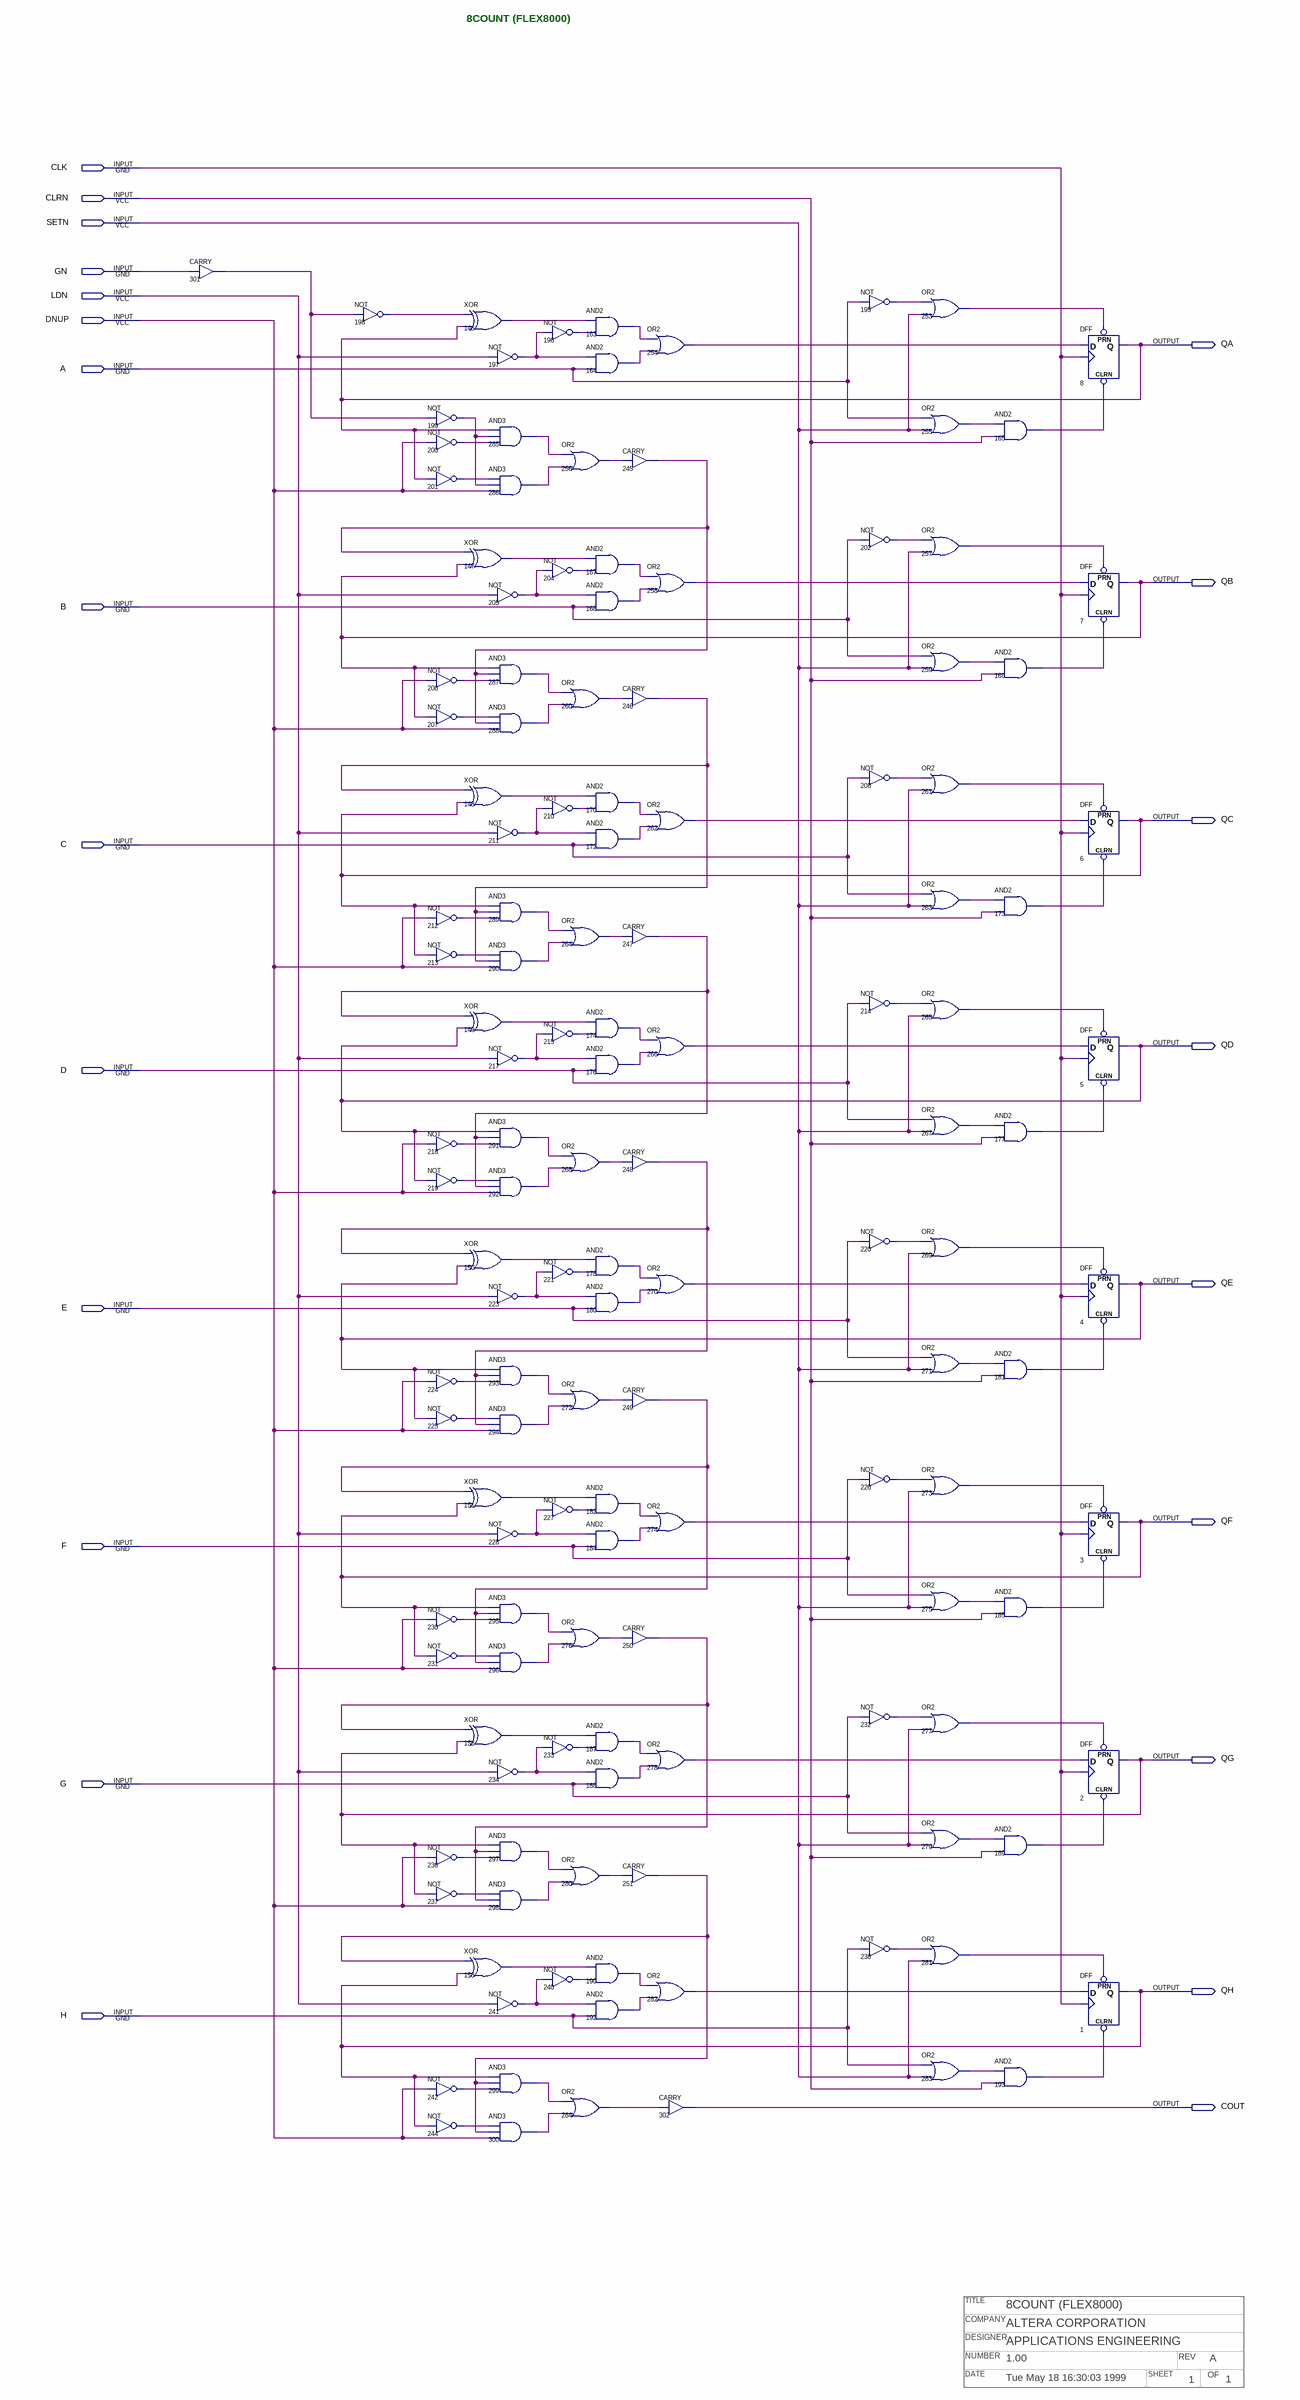
[diagram p0: schematic sheet]
// Quartus schematic f8count.bdf as structural Verilog: 139 symbols, 23 pins
// Title block: TITLE: 8COUNT (FLEX8000); COMPANY: ALTERA CORPORATION; DESIGNER: APPLICATIONS ENGINEERING; NUMBER: 1.00; REV: A; DATE: Tue May 18 16:30:03 1999; SHEET: 1; OF: 1
module f8count (
  input  CLK,
  input  CLRN,
  input  SETN,
  input  GN,
  input  LDN,
  input  DNUP,
  input  A,
  input  B,
  input  C,
  input  D,
  input  E,
  input  F,
  input  G,
  input  H,
  output QA,
  output QB,
  output QC,
  output QD,
  output QE,
  output QF,
  output QG,
  output QH,
  output COUT
);

  wire n146_out, n147_out, n148_out, n149_out, n150_out, n151_out, n152_out, n153_out, n163_out, n164_out,
       n165_out, n167_out, n168_out, n169_out, n170_out, n172_out, n173_out, n174_out, n176_out, n177_out,
       n178_out, n180_out, n181_out, n182_out, n184_out, n185_out, n187_out, n188_out, n189_out, n190_out,
       n192_out, n193_out, n195_out, n196_out, n197_out, n198_out, n199_out, n200_out, n201_out, n202_out,
       n204_out, n205_out, n206_out, n207_out, n208_out, n210_out, n211_out, n212_out, n213_out, n214_out,
       n215_out, n217_out, n218_out, n219_out, n220_out, n221_out, n223_out, n224_out, n225_out, n226_out,
       n227_out, n228_out, n230_out, n231_out, n232_out, n233_out, n234_out, n236_out, n237_out, n238_out,
       n240_out, n241_out, n242_out, n244_out, n245_out, n246_out, n247_out, n248_out, n249_out, n250_out,
       n251_out, n253_out, n254_out, n255_out, n256_out, n257_out, n258_out, n259_out, n260_out, n261_out,
       n262_out, n263_out, n264_out, n265_out, n266_out, n267_out, n268_out, n269_out, n270_out, n271_out,
       n272_out, n273_out, n274_out, n275_out, n276_out, n277_out, n278_out, n279_out, n280_out, n281_out,
       n282_out, n283_out, n284_out, n285_out, n286_out, n287_out, n288_out, n289_out, n290_out, n291_out,
       n292_out, n293_out, n294_out, n295_out, n296_out, n297_out, n298_out, n299_out, n300_out, n301_out;

  CARRY u_301 (.IN(GN), .OUT(n301_out));
  not u_198 (n198_out, n301_out);
  not u_199 (n199_out, n301_out);
  not u_200 (n200_out, DNUP);
  not u_201 (n201_out, QA);
  not u_206 (n206_out, DNUP);
  not u_207 (n207_out, QB);
  not u_212 (n212_out, DNUP);
  not u_213 (n213_out, QC);
  not u_218 (n218_out, DNUP);
  not u_219 (n219_out, QD);
  not u_224 (n224_out, DNUP);
  not u_225 (n225_out, QE);
  not u_230 (n230_out, DNUP);
  not u_231 (n231_out, QF);
  not u_236 (n236_out, DNUP);
  not u_237 (n237_out, QG);
  not u_242 (n242_out, DNUP);
  not u_244 (n244_out, QH);
  xor u_146 (n146_out, n198_out, QA);
  not u_197 (n197_out, LDN);
  and u_285 (n285_out, QA, n199_out, n200_out);
  and u_286 (n286_out, n201_out, n199_out, DNUP);
  xor u_147 (n147_out, n245_out, QB);
  not u_205 (n205_out, LDN);
  and u_287 (n287_out, QB, n245_out, n206_out);
  and u_288 (n288_out, n207_out, n245_out, DNUP);
  xor u_148 (n148_out, n246_out, QC);
  not u_211 (n211_out, LDN);
  and u_289 (n289_out, QC, n246_out, n212_out);
  and u_290 (n290_out, n213_out, n246_out, DNUP);
  xor u_149 (n149_out, n247_out, QD);
  not u_217 (n217_out, LDN);
  and u_291 (n291_out, QD, n247_out, n218_out);
  and u_292 (n292_out, n219_out, n247_out, DNUP);
  xor u_150 (n150_out, n248_out, QE);
  not u_223 (n223_out, LDN);
  and u_293 (n293_out, QE, n248_out, n224_out);
  and u_294 (n294_out, n225_out, n248_out, DNUP);
  xor u_151 (n151_out, n249_out, QF);
  not u_228 (n228_out, LDN);
  and u_295 (n295_out, QF, n249_out, n230_out);
  and u_296 (n296_out, n231_out, n249_out, DNUP);
  xor u_152 (n152_out, n250_out, QG);
  not u_234 (n234_out, LDN);
  and u_297 (n297_out, QG, n250_out, n236_out);
  and u_298 (n298_out, n237_out, n250_out, DNUP);
  xor u_153 (n153_out, n251_out, QH);
  not u_241 (n241_out, LDN);
  and u_299 (n299_out, QH, n251_out, n242_out);
  and u_300 (n300_out, n244_out, n251_out, DNUP);
  and u_163 (n163_out, n146_out, n196_out);
  not u_196 (n196_out, n197_out);
  and u_164 (n164_out, n197_out, A);
  or u_256 (n256_out, n285_out, n286_out);
  and u_167 (n167_out, n147_out, n204_out);
  not u_204 (n204_out, n205_out);
  and u_168 (n168_out, n205_out, B);
  or u_260 (n260_out, n287_out, n288_out);
  and u_170 (n170_out, n148_out, n210_out);
  not u_210 (n210_out, n211_out);
  and u_172 (n172_out, n211_out, C);
  or u_264 (n264_out, n289_out, n290_out);
  and u_174 (n174_out, n149_out, n215_out);
  not u_215 (n215_out, n217_out);
  and u_176 (n176_out, n217_out, D);
  or u_268 (n268_out, n291_out, n292_out);
  and u_178 (n178_out, n150_out, n221_out);
  not u_221 (n221_out, n223_out);
  and u_180 (n180_out, n223_out, E);
  or u_272 (n272_out, n293_out, n294_out);
  and u_182 (n182_out, n151_out, n227_out);
  not u_227 (n227_out, n228_out);
  and u_184 (n184_out, n228_out, F);
  or u_276 (n276_out, n295_out, n296_out);
  and u_187 (n187_out, n152_out, n233_out);
  not u_233 (n233_out, n234_out);
  and u_188 (n188_out, n234_out, G);
  or u_280 (n280_out, n297_out, n298_out);
  and u_190 (n190_out, n153_out, n240_out);
  not u_240 (n240_out, n241_out);
  and u_192 (n192_out, n241_out, H);
  or u_284 (n284_out, n299_out, n300_out);
  CARRY u_245 (.IN(n256_out), .OUT(n245_out));
  CARRY u_246 (.IN(n260_out), .OUT(n246_out));
  CARRY u_247 (.IN(n264_out), .OUT(n247_out));
  CARRY u_248 (.IN(n268_out), .OUT(n248_out));
  CARRY u_249 (.IN(n272_out), .OUT(n249_out));
  CARRY u_250 (.IN(n276_out), .OUT(n250_out));
  CARRY u_251 (.IN(n280_out), .OUT(n251_out));
  or u_254 (n254_out, n163_out, n164_out);
  or u_258 (n258_out, n167_out, n168_out);
  or u_262 (n262_out, n170_out, n172_out);
  or u_266 (n266_out, n174_out, n176_out);
  or u_270 (n270_out, n178_out, n180_out);
  or u_274 (n274_out, n182_out, n184_out);
  or u_278 (n278_out, n187_out, n188_out);
  or u_282 (n282_out, n190_out, n192_out);
  CARRY u_302 (.IN(n284_out), .OUT(COUT));
  not u_195 (n195_out, A);
  not u_202 (n202_out, B);
  not u_208 (n208_out, C);
  not u_214 (n214_out, D);
  not u_220 (n220_out, E);
  not u_226 (n226_out, F);
  not u_232 (n232_out, G);
  not u_238 (n238_out, H);
  or u_253 (n253_out, n195_out, SETN);
  or u_255 (n255_out, A, SETN);
  or u_257 (n257_out, n202_out, SETN);
  or u_259 (n259_out, B, SETN);
  or u_261 (n261_out, n208_out, SETN);
  or u_263 (n263_out, C, SETN);
  or u_265 (n265_out, n214_out, SETN);
  or u_267 (n267_out, D, SETN);
  or u_269 (n269_out, n220_out, SETN);
  or u_271 (n271_out, E, SETN);
  or u_273 (n273_out, n226_out, SETN);
  or u_275 (n275_out, F, SETN);
  or u_277 (n277_out, n232_out, SETN);
  or u_279 (n279_out, G, SETN);
  or u_281 (n281_out, n238_out, SETN);
  or u_283 (n283_out, H, SETN);
  and u_165 (n165_out, n255_out, CLRN);
  and u_169 (n169_out, n259_out, CLRN);
  and u_173 (n173_out, n263_out, CLRN);
  and u_177 (n177_out, n267_out, CLRN);
  and u_181 (n181_out, n271_out, CLRN);
  and u_185 (n185_out, n275_out, CLRN);
  and u_189 (n189_out, n279_out, CLRN);
  and u_193 (n193_out, n283_out, CLRN);
  DFF u_8 (.CLRN(n165_out), .CLK(CLK), .D(n254_out), .PRN(n253_out), .Q(QA));
  DFF u_7 (.CLRN(n169_out), .CLK(CLK), .D(n258_out), .PRN(n257_out), .Q(QB));
  DFF u_6 (.CLRN(n173_out), .CLK(CLK), .D(n262_out), .PRN(n261_out), .Q(QC));
  DFF u_5 (.CLRN(n177_out), .CLK(CLK), .D(n266_out), .PRN(n265_out), .Q(QD));
  DFF u_4 (.CLRN(n181_out), .CLK(CLK), .D(n270_out), .PRN(n269_out), .Q(QE));
  DFF u_3 (.CLRN(n185_out), .CLK(CLK), .D(n274_out), .PRN(n273_out), .Q(QF));
  DFF u_2 (.CLRN(n189_out), .CLK(CLK), .D(n278_out), .PRN(n277_out), .Q(QG));
  DFF u_1 (.CLRN(n193_out), .CLK(CLK), .D(n282_out), .PRN(n281_out), .Q(QH));

  // Notes on the sheet:
  //   8COUNT (FLEX8000)
endmodule
